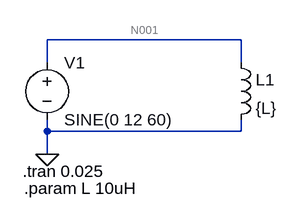
[diagram p0: schematic L_circuit.asc]
L_circuit.asc, the LTspice schematic file:
Version 4
SHEET 1 880 680
WIRE 320 64 48 64
WIRE 48 96 48 64
WIRE 320 96 320 64
WIRE 48 192 48 176
WIRE 320 192 320 176
WIRE 320 192 48 192
WIRE 48 224 48 192
FLAG 48 224 0
SYMBOL voltage 48 80 R0
WINDOW 123 0 0 Left 2
WINDOW 39 0 0 Left 2
SYMATTR InstName V1
SYMATTR Value SINE(0 12 60)
SYMBOL ind 304 80 R0
SYMATTR InstName L1
SYMATTR Value {L}
TEXT 14 248 Left 2 !.tran 0.025
TEXT 16 272 Left 2 !.param L 10uH

The netlist it stands for:
* L_circuit.asc
V1 N001 0 SINE(0 12 60)
L1 N001 0 {L}
.tran 0.025
.param L 10uH
.backanno
.end

* Results of the author's LTspice run, read from the files saved beside the schematic
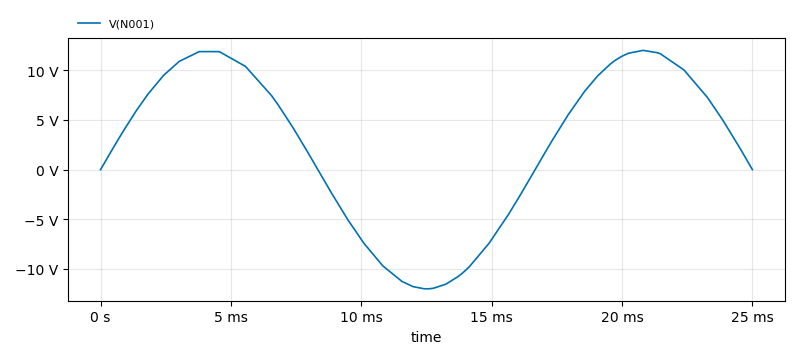
[diagram p1: Transient Analysis of L_circuit.asc, plotted from the saved traces]
* Transient Analysis, 1 run:
*   V(N001): min -11.99 V, max 12 V, average 2.526 V, rms 8.471 V, last 0 V